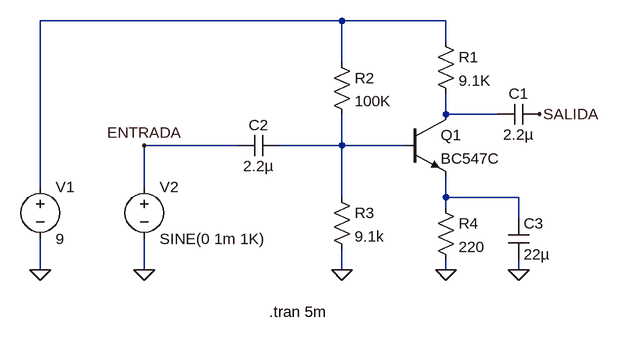
[diagram p0: schematic transistor-amplificador-1-etapa-estabilizado.asc]
transistor-amplificador-1-etapa-estabilizado.asc, the LTspice schematic file:
Version 4
SHEET 1 880 680
WIRE 208 -48 -256 -48
WIRE 368 -48 208 -48
WIRE 368 -16 368 -48
WIRE 208 16 208 -48
WIRE 368 96 368 64
WIRE 448 96 368 96
WIRE 48 144 -96 144
WIRE 208 144 208 96
WIRE 208 144 112 144
WIRE 304 144 208 144
WIRE -256 208 -256 -48
WIRE -96 208 -96 144
WIRE 208 224 208 144
WIRE 368 224 368 192
WIRE 480 224 368 224
WIRE 368 240 368 224
WIRE 480 256 480 224
WIRE -256 336 -256 288
WIRE -96 336 -96 288
WIRE 208 336 208 304
WIRE 368 336 368 320
WIRE 480 336 480 320
FLAG -96 336 0
FLAG 368 336 0
FLAG -256 336 0
FLAG 512 96 SALIDA
FLAG -96 144 ENTRADA
FLAG 208 336 0
FLAG 480 336 0
SYMBOL npn 304 96 R0
SYMATTR InstName Q1
SYMATTR Value BC547C
SYMBOL res 352 -32 R0
SYMATTR InstName R1
SYMATTR Value 9.1K
SYMBOL voltage -256 192 R0
WINDOW 123 0 0 Left 0
WINDOW 39 0 0 Left 0
SYMATTR InstName V1
SYMATTR Value 9
SYMBOL voltage -96 192 R0
WINDOW 123 0 0 Left 0
WINDOW 39 0 0 Left 0
SYMATTR InstName V2
SYMATTR Value SINE(0 1m 1K)
SYMBOL cap 512 80 R90
WINDOW 0 0 32 VBottom 2
WINDOW 3 32 32 VTop 2
SYMATTR InstName C1
SYMATTR Value 2.2µ
SYMBOL cap 112 128 R90
WINDOW 0 0 32 VBottom 2
WINDOW 3 32 32 VTop 2
SYMATTR InstName C2
SYMATTR Value 2.2µ
SYMBOL res 192 0 R0
SYMATTR InstName R2
SYMATTR Value 100K
SYMBOL res 192 208 R0
SYMATTR InstName R3
SYMATTR Value 9.1k
SYMBOL res 352 224 R0
SYMATTR InstName R4
SYMATTR Value 220
SYMBOL cap 464 256 R0
SYMATTR InstName C3
SYMATTR Value 22µ
TEXT 96 400 Left 2 !.tran 5m

The netlist it stands for:
* transistor-amplificador-1-etapa-estabilizado.asc
Q1 N002 N003 N004 0 BC547C
R1 N001 N002 9.1K
V1 N001 0 9
V2 ENTRADA 0 SINE(0 1m 1K)
C1 SALIDA N002 2.2µ
C2 N003 ENTRADA 2.2µ
R2 N001 N003 100K
R3 N003 0 9.1k
R4 N004 0 220
C3 N004 0 22µ
.model NPN NPN
.model PNP PNP
.lib standard.bjt
.tran 5m
.backanno
.end